# Altium schematic sheet 5_wiring drawing.SchDoc: PMU
size A2; ApprovedBy: Approved By; CheckedBy: Sky Ma; DrawnBy: Jack; Address1: 1; Address2: 2; Address3: 3; Address4: 4; DocumentNumber: 04-TE-42-4015-0PA-A; Revision: A; SheetNumber: 6; SheetTotal: 6; SheetSize: A2; CheckedByDate: 2022-12-5; DrawByDate: 2022-12-5; SiteName: EMS TD Huangpu; ProjectName: 19205_BMW CCU DDR PCBA FT fixture wiring
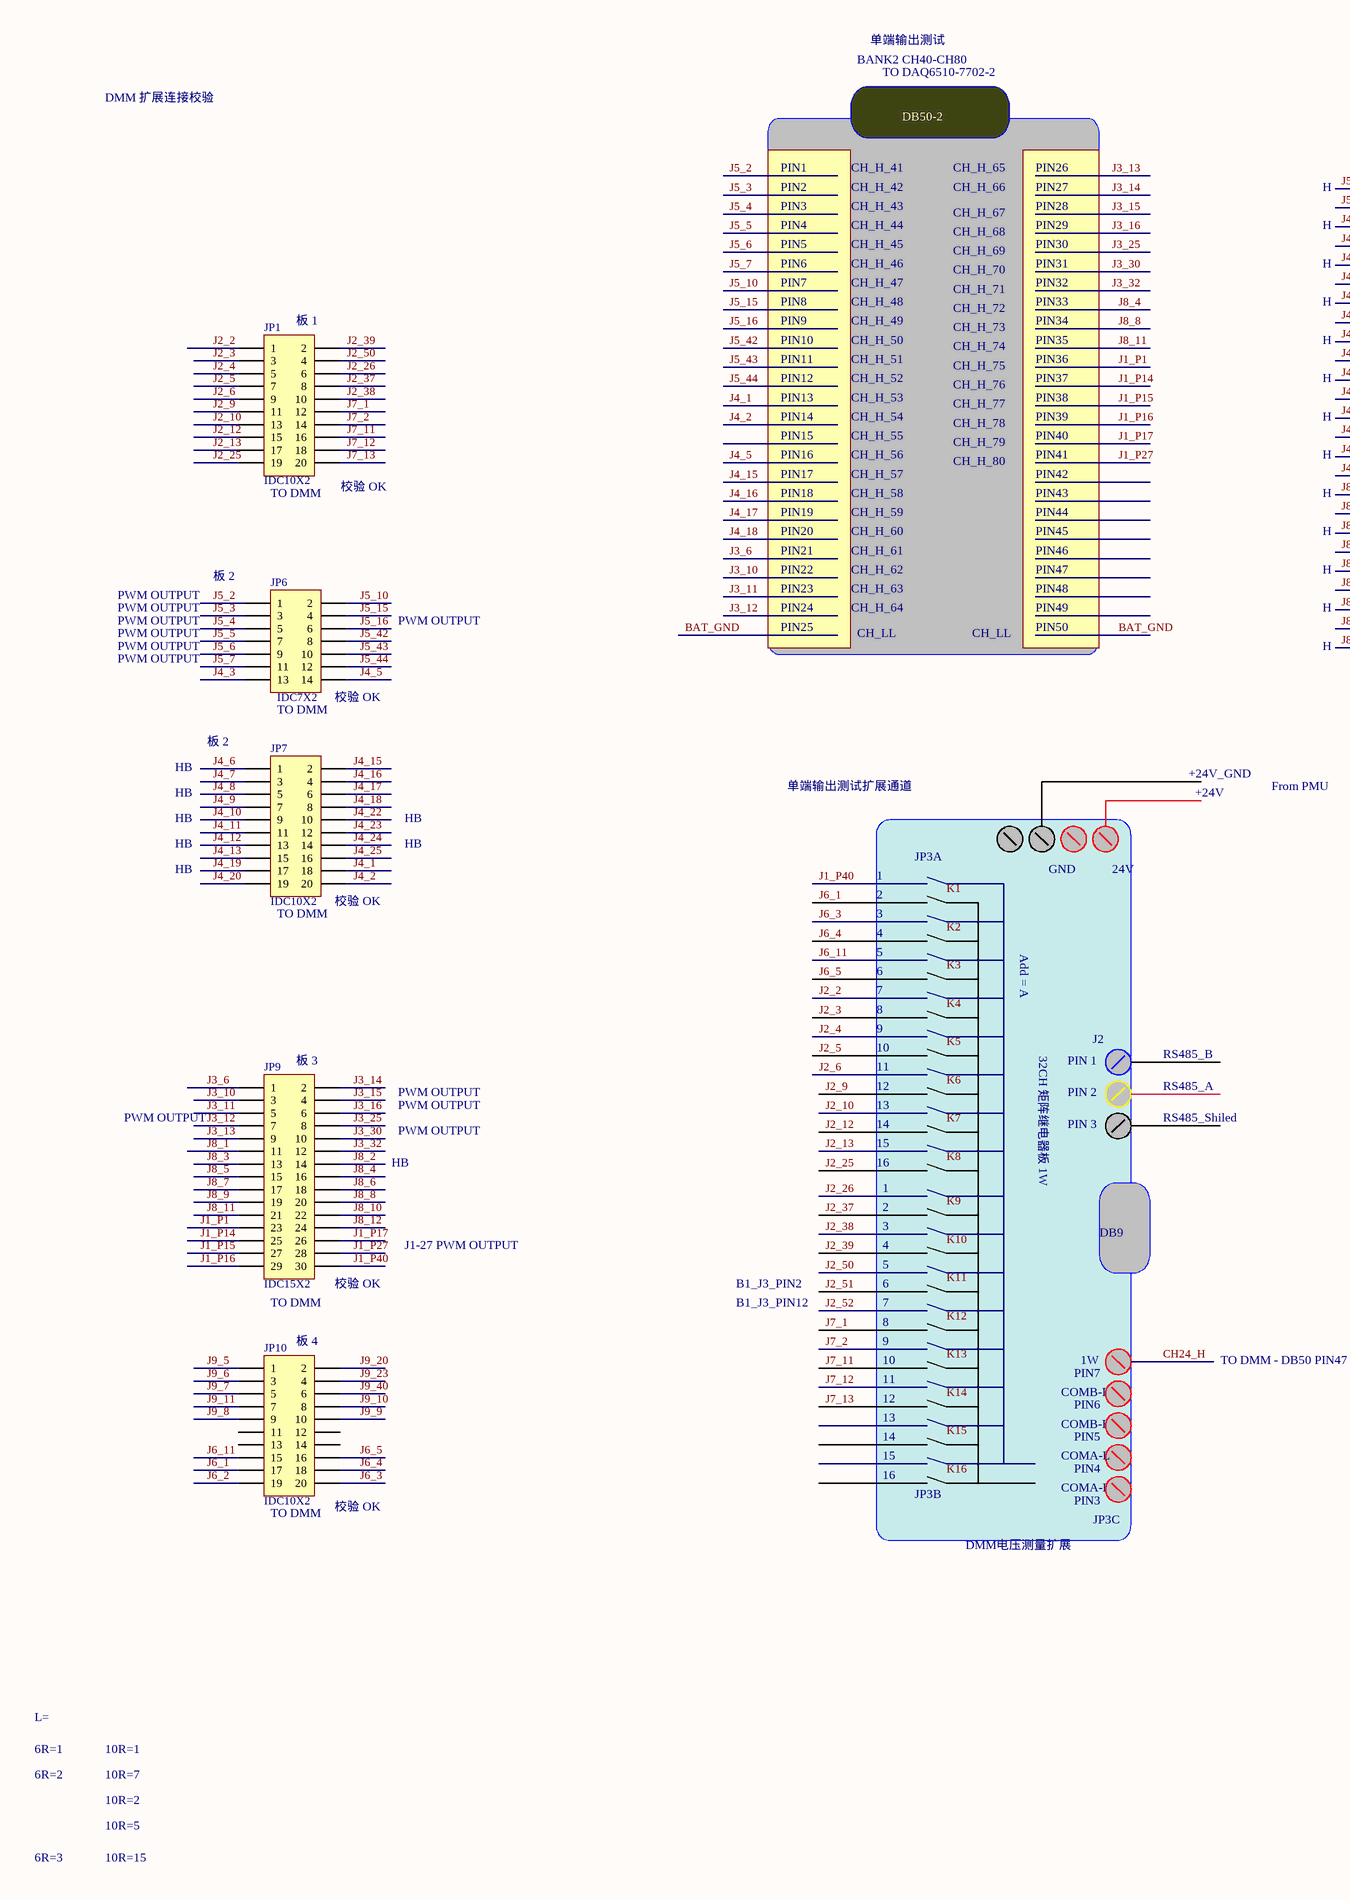
[diagram p0: 5_wiring drawing.SchDoc, left]
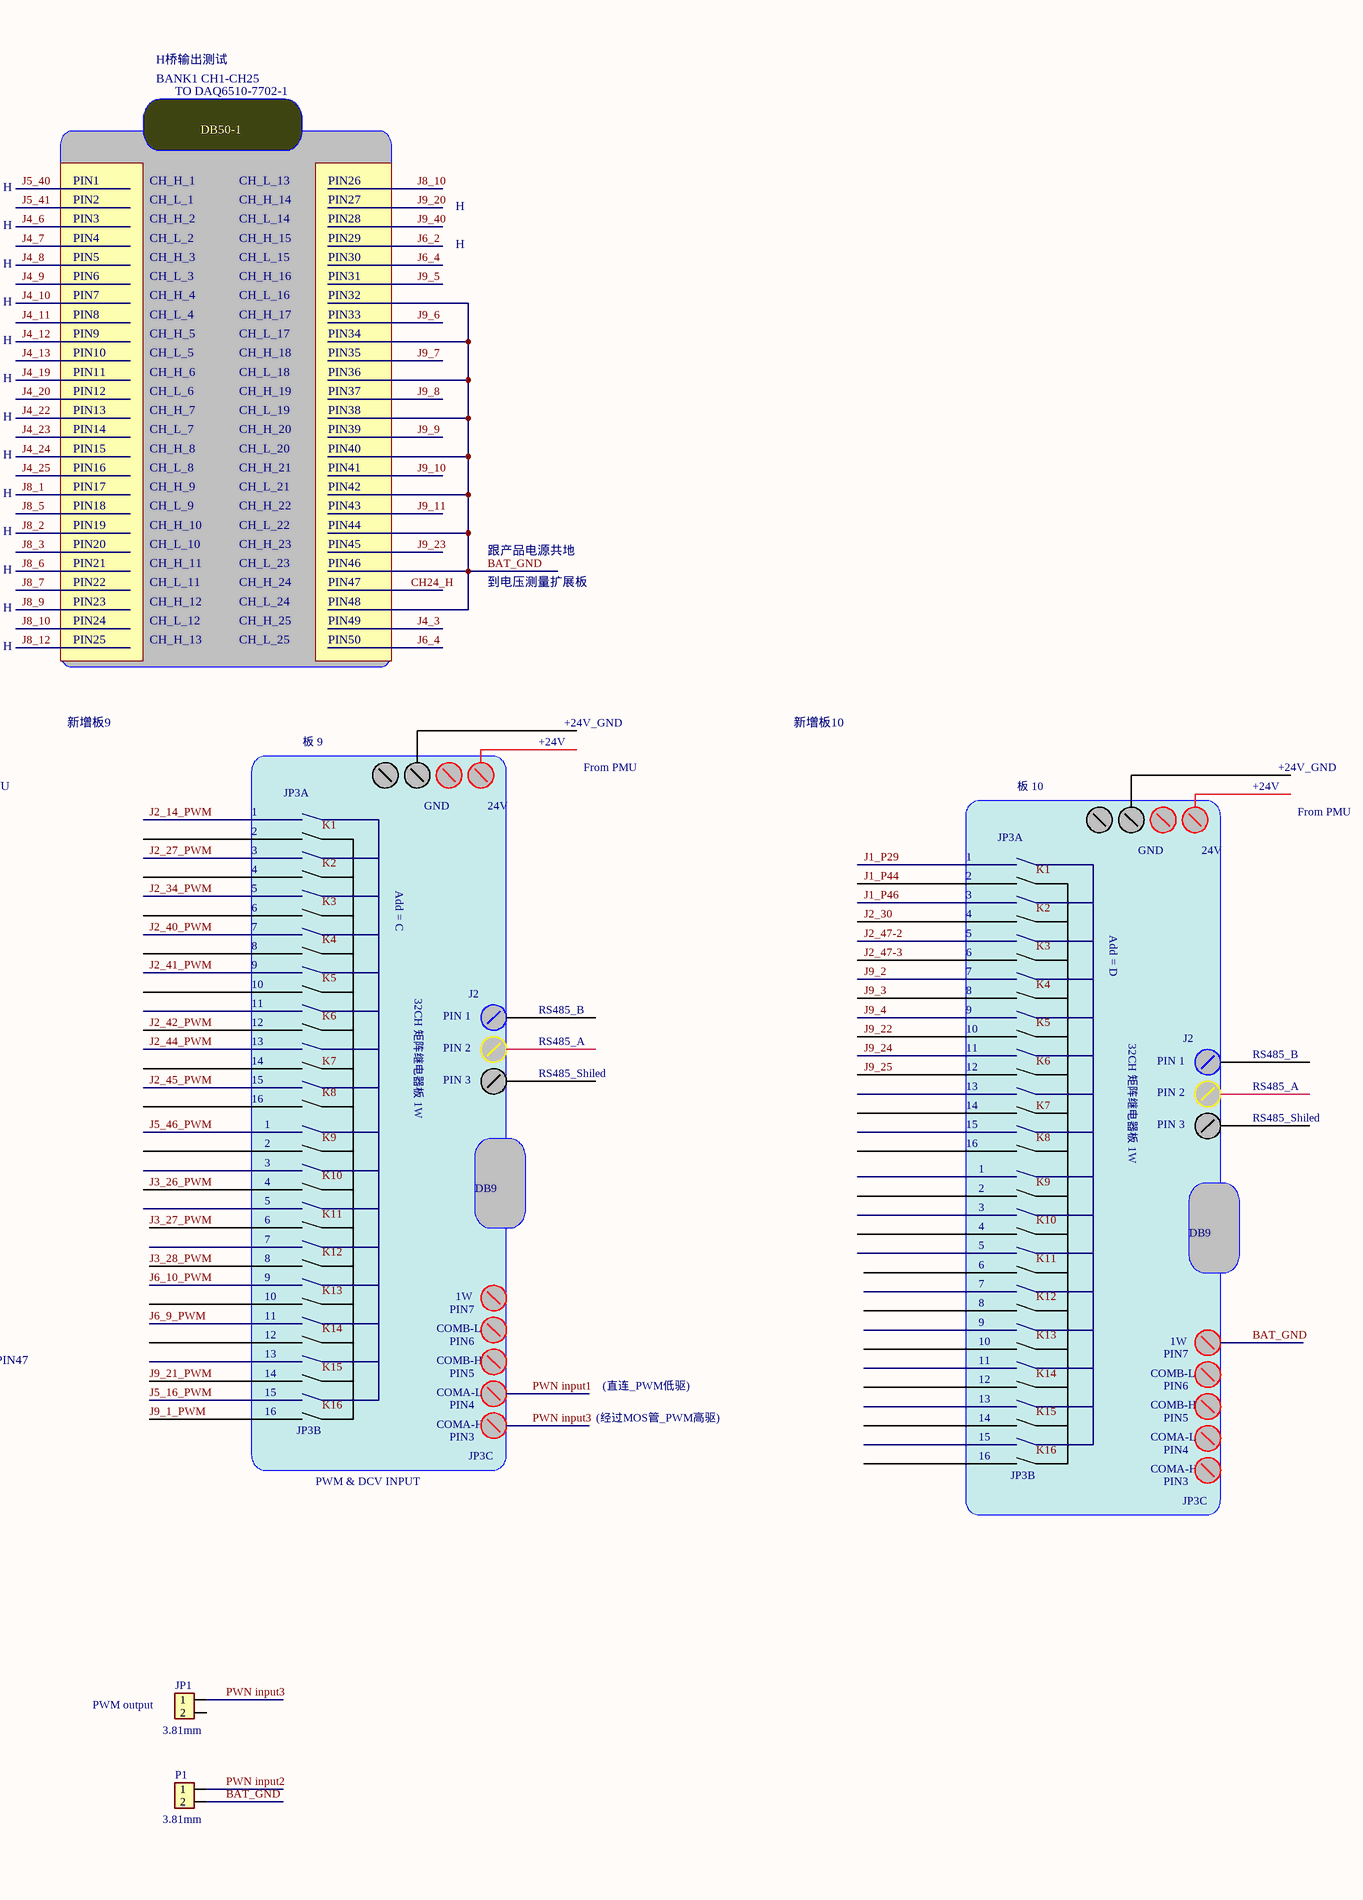
[diagram p1: 5_wiring drawing.SchDoc, right]

## Parts
(Parts that share a designator on the sheet are numbered #1, #2 ... from top to bottom, then left to right.)
JP1#1  IDC10X2  [IDC20]
JP1#2  3.81mm  [3.81mm-2]
JP6  IDC7X2  [IDC14]
JP7  IDC10X2  [IDC20]
JP9  IDC15X2  [IDC30]
JP10  IDC10X2  [IDC20]
P1  3.81mm  [3.81mm-2]

## Nets
BAT_GND: P1.2
J1_P1: JP9.23
J1_P14: JP9.25
J1_P15: JP9.27
J1_P16: JP9.29
J1_P17: JP9.26
J1_P27: JP9.28
J1_P40: JP9.30
J2_2: JP1#1.1
J2_3: JP1#1.3
J2_4: JP1#1.5
J2_5: JP1#1.7
J2_6: JP1#1.9
J2_9: JP1#1.11
J2_10: JP1#1.13
J2_12: JP1#1.15
J2_13: JP1#1.17
J2_25: JP1#1.19
J2_26: JP1#1.6
J2_37: JP1#1.8
J2_38: JP1#1.10
J2_39: JP1#1.2
J2_50: JP1#1.4
J3_6: JP9.1
J3_10: JP9.3
J3_11: JP9.5
J3_12: JP9.7
J3_13: JP9.9
J3_14: JP9.2
J3_15: JP9.4
J3_16: JP9.6
J3_25: JP9.8
J3_30: JP9.10
J3_32: JP9.12
J4_1: JP7.18
J4_2: JP7.20
J4_3: JP6.13
J4_5: JP6.14
J4_6: JP7.1
J4_7: JP7.3
J4_8: JP7.5
J4_9: JP7.7
J4_10: JP7.9
J4_11: JP7.11
J4_12: JP7.13
J4_13: JP7.15
J4_15: JP7.2
J4_16: JP7.4
J4_17: JP7.6
J4_18: JP7.8
J4_19: JP7.17
J4_20: JP7.19
J4_22: JP7.10
J4_23: JP7.12
J4_24: JP7.14
J4_25: JP7.16
J5_2: JP6.1
J5_3: JP6.3
J5_4: JP6.5
J5_5: JP6.7
J5_6: JP6.9
J5_7: JP6.11
J5_10: JP6.2
J5_15: JP6.4
J5_16: JP6.6
J5_42: JP6.8
J5_43: JP6.10
J5_44: JP6.12
J6_1: JP10.17
J6_2: JP10.19
J6_3: JP10.20
J6_4: JP10.18
J6_5: JP10.16
J6_11: JP10.15
J7_1: JP1#1.12
J7_2: JP1#1.14
J7_11: JP1#1.16
J7_12: JP1#1.18
J7_13: JP1#1.20
J8_1: JP9.11
J8_2: JP9.14
J8_3: JP9.13
J8_4: JP9.16
J8_5: JP9.15
J8_6: JP9.18
J8_7: JP9.17
J8_8: JP9.20
J8_9: JP9.19
J8_10: JP9.22
J8_11: JP9.21
J8_12: JP9.24
J9_5: JP10.1
J9_6: JP10.3
J9_7: JP10.5
J9_8: JP10.9
J9_9: JP10.10
J9_10: JP10.8
J9_11: JP10.7
J9_20: JP10.2
J9_23: JP10.4
J9_40: JP10.6
PWN input2: P1.1
PWN input3: JP1#2.1

Not connected (* = marked no-connect by the designer): JP1#2 2; JP10 11 12 13 14

## Notes on the sheet
- BANK2 CH40-CH80
- 单端输出测试
- TO DAQ6510-7702-2
- H桥输出测试
- BANK1 CH1-CH25
- TO DAQ6510-7702-1
- DMM 扩展连接校验
- DB50-2
- DB50-1
- PIN1
- PIN2
- PIN3
- CH_H_41
- CH_H_42
- CH_H_43
- CH_H_65
- CH_H_66
- CH_H_67
- PIN26
- PIN27
- PIN28
- H
- CH_H_1
- CH_H_2
- CH_L_1
- CH_H_14
- CH_L_13
- CH_L_14
- PIN4
- PIN5
- PIN6
- CH_H_44
- CH_H_45
- CH_H_46
- CH_H_68
- CH_H_69
- CH_H_70
- PIN29
- PIN30
- PIN31
- CH_H_3
- CH_L_2
- CH_L_3
- CH_H_15
- CH_H_16
- CH_L_15
- (near JP1#1) 板 1
- PIN7
- PIN8
- PIN9
- PIN10
- CH_H_47
- CH_H_48
- CH_H_49
- CH_H_50
- CH_H_71
- CH_H_72
- CH_H_73
- CH_H_74
- PIN32
- PIN33
- PIN34
- PIN35
- CH_H_4
- CH_H_5
- CH_L_4
- CH_H_17
- CH_L_16
- CH_L_17
- PIN11
- PIN12
- PIN13
- CH_H_51
- CH_H_52
- CH_H_53
- CH_H_75
- CH_H_76
- CH_H_77
- PIN36
- PIN37
- PIN38
- CH_H_6
- CH_L_5
- CH_L_6
- CH_H_18
- CH_H_19
- CH_L_18
- PIN14
- PIN15
- PIN16
- PIN17
- CH_H_54
- CH_H_55
- CH_H_56
- CH_H_57
- CH_H_78
- CH_H_79
- CH_H_80
- PIN39
- PIN40
- PIN41
- PIN42
- CH_H_7
- CH_H_8
- CH_L_7
- CH_L_8
- CH_H_20
- CH_H_21
- CH_L_19
- CH_L_20
- (near JP1#1) TO DMM
- (near JP1#1) 校验 OK
- PIN18
- PIN19
- PIN20
- CH_H_58
- CH_H_59
- CH_H_60
- PIN43
- PIN44
- PIN45
- CH_H_9
- CH_H_10
- CH_L_9
- CH_H_22
- CH_L_21
- CH_L_22
- PWM OUTPUT
- (near JP6) 板 2
- PIN21
- PIN22
- PIN23
- CH_H_61
- CH_H_62
- CH_H_63
- PIN46
- PIN47
- PIN48
- CH_H_11
- CH_H_12
- CH_L_10
- CH_L_11
- CH_H_23
- CH_H_24
- CH_L_23
- CH_L_24
- 跟产品电源共地
- 到电压测量扩展板
- PIN24
- PIN25
- CH_H_64
- CH_LL
- PIN49
- PIN50
- CH_H_13
- CH_L_12
- CH_H_25
- CH_L_25
- (near JP6) TO DMM
- (near JP6) 校验 OK
- 新增板9
- +24V_GND
- 新增板10
- HB
- 板 2
- 单端输出测试扩展通道
- From PMU
- 板 9
- +24V
- 板 10
- JP3A
- 1
- 2
- 3
- GND
- 24V
- (near JP7) TO DMM
- (near JP7) 校验 OK
- 4
- 5
- 6
- Add = C
- Add = A
- 7
- 8
- 9
- 10
- J2
- Add = D
- 11
- 12
- 13
- 32CH 矩阵继电器板 1W
- PIN 1
- RS485_B
- RS485_A
- (near JP9) 板 3
- PIN 2
- 14
- 15
- 16
- PIN 3
- RS485_Shiled
- DB9
- (near JP9) 校验 OK
- J1-27 PWM OUTPUT
- B1_J3_PIN2
- 1W
- (near JP9) TO DMM
- (near JP10) 板 4
- B1_J3_PIN12
- TO DMM - DB50 PIN47
- COMB-L
- COMB-H
- COMA-L
- COMA-H
- (经过MOS管_PWM高驱)
- (直连_PWM低驱)
- JP3B
- PWM & DCV INPUT
- JP3C
- (near JP10) TO DMM
- (near JP10) 校验 OK
- DMM电压测量扩展
- 6R=1
- L=
- 10R=1
- (near JP1#2) PWM output
- 6R=2
- 10R=2
- 10R=7
- 6R=3
- 10R=15
- 10R=5
- Labels drawn without touching a wire or pin: J1_P29, J1_P40, J1_P44, J1_P46, J2_2, J2_3, J2_4, J2_5, J2_6, J2_9, J2_10, J2_12, J2_13, J2_14_PWM, J2_25, J2_26, J2_27_PWM, J2_30, J2_34_PWM, J2_37, J2_38, J2_39, J2_40_PWM, J2_41_PWM, J2_42_PWM, J2_44_PWM, J2_45_PWM, J2_47-2, J2_47-3, J2_50, J2_51, J2_52, J3_26_PWM, J3_27_PWM, J3_28_PWM, J5_16_PWM, J5_46_PWM, J6_1, J6_3, J6_4, J6_5, J6_9_PWM, J6_10_PWM, J6_11, J7_1, J7_2, J7_11, J7_12, J7_13, J9_1_PWM, J9_2, J9_3, J9_4, J9_21_PWM, J9_22, J9_24, J9_25, K1, K2, K3, K4, K5, K6, K7, K8, K9, K10, K11, K12, K13, K14, K15, K16
- Document Number:
- Rev:
- Project Name:
- Drawn By:
- Date:
- Titile:
- Checked By:
- Sheet:
- Of

## Library data of the parts
JP1#2 P1 = CON2-3.81